# EAGLE design CubeX2000 (EAGLE 6.5.0)
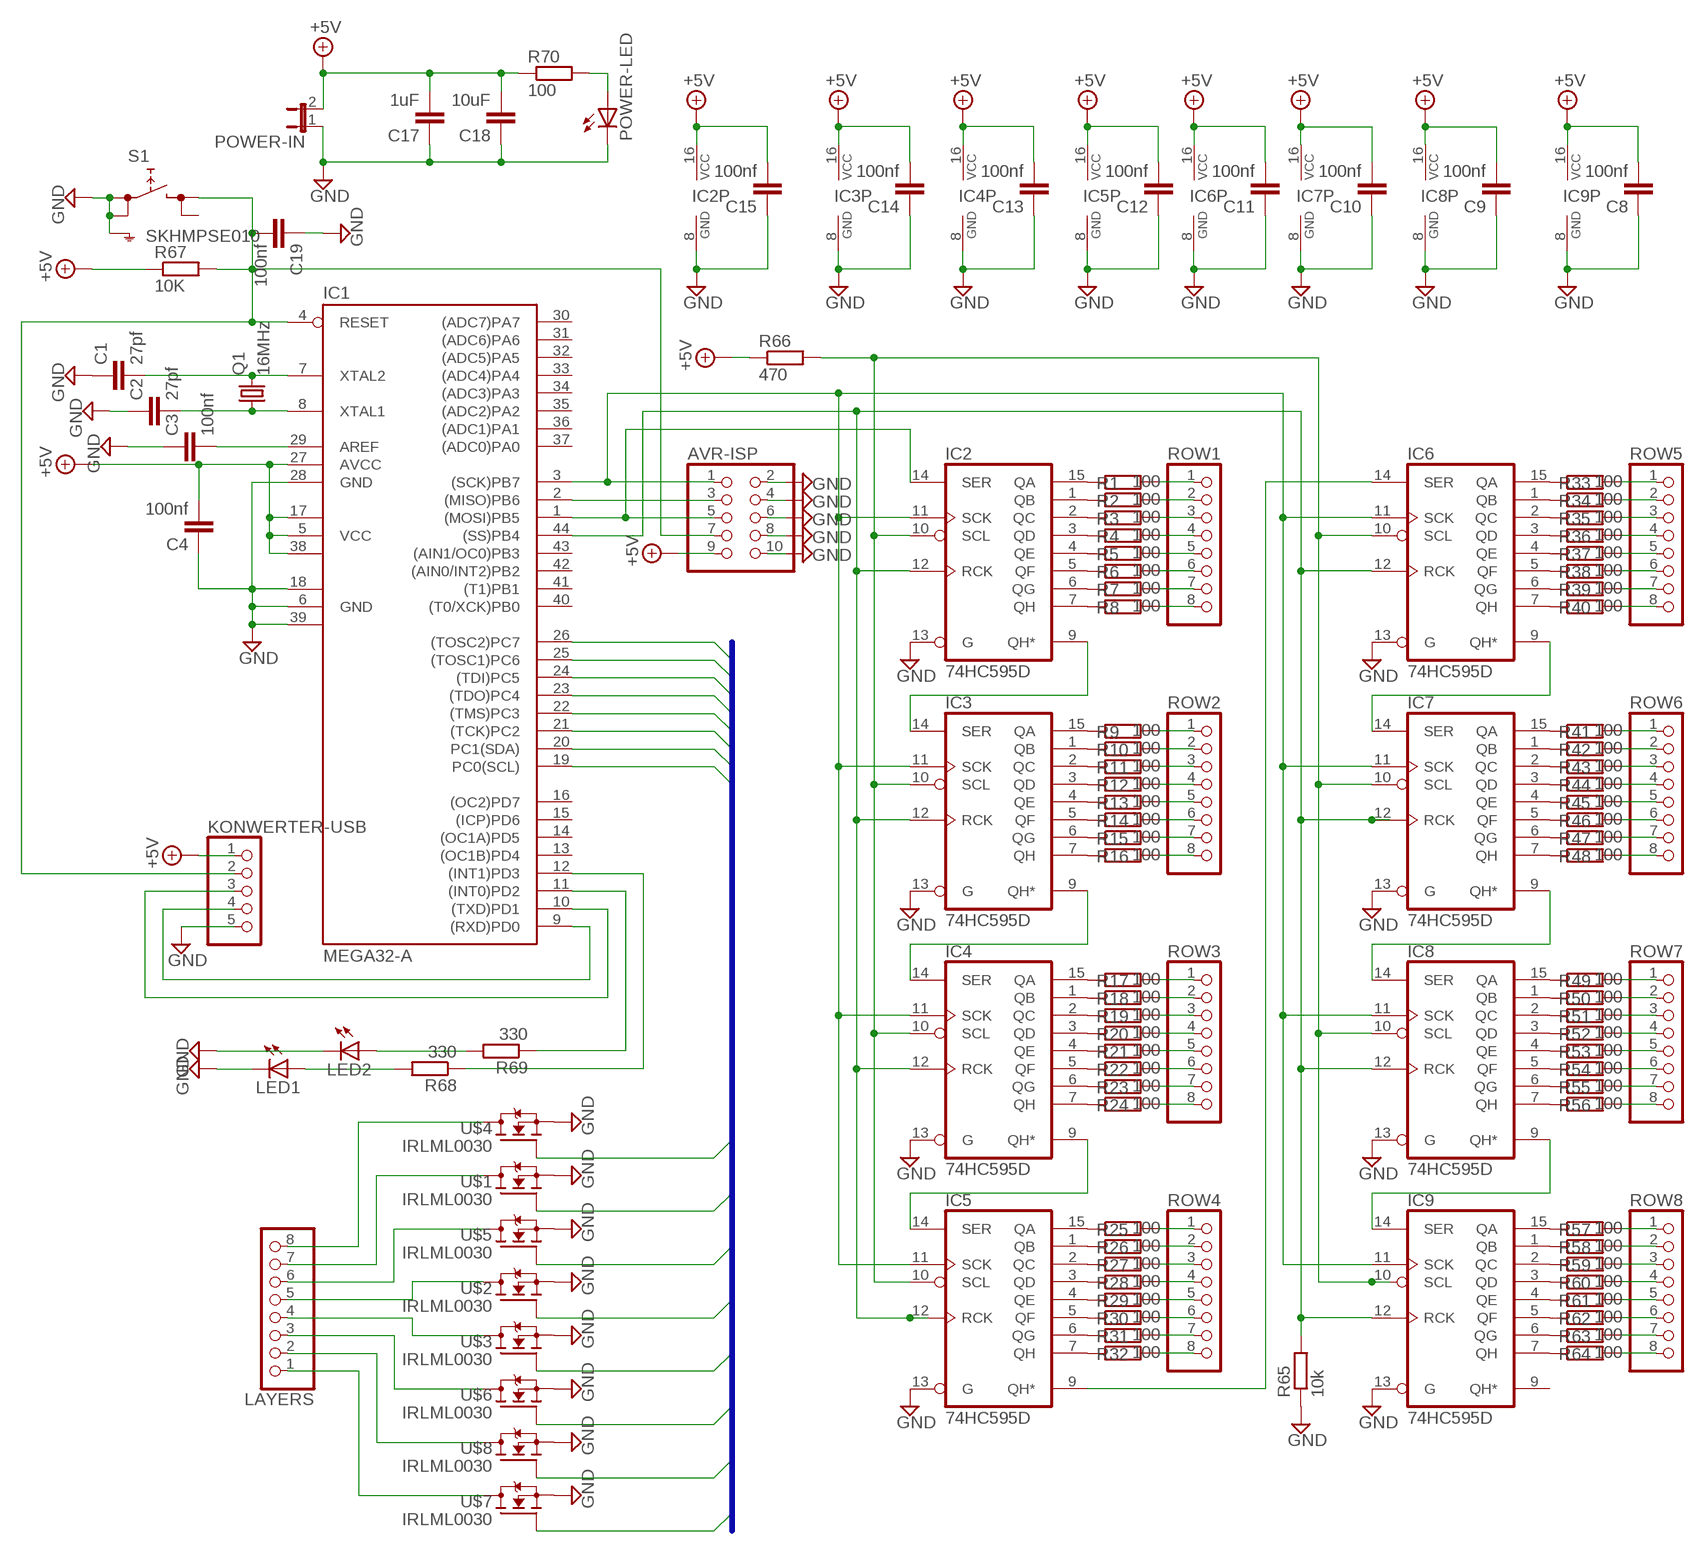
[diagram p0: schematic, sheet 1]

## Parts
AVR-ISP  PINHD-2X5  [2X05]
C1  27pf  C-EUC1206  [C1206]
C2  27pf  C-EUC1206  [C1206]
C3  100nf  C-EUC1206  [C1206]
C4  100nf  C-EUC1206  [C1206]
C8  100nf  C-EUC1206  [C1206]
C9  100nf  C-EUC1206  [C1206]
C10  100nf  C-EUC1206  [C1206]
C11  100nf  C-EUC1206  [C1206]
C12  100nf  C-EUC1206  [C1206]
C13  100nf  C-EUC1206  [C1206]
C14  100nf  C-EUC1206  [C1206]
C15  100nf  C-EUC1206  [C1206]
C17  1uF  C-EUC1206  [C1206]
C18  10uF  C-EUC1206  [C1206]
C19  100nf  C-EUC1206  [C1206]
IC1  MEGA32-A  [TQFP44]
IC2  74HC595D  [SO16]
IC3  74HC595D  [SO16]
IC4  74HC595D  [SO16]
IC5  74HC595D  [SO16]
IC6  74HC595D  [SO16]
IC7  74HC595D  [SO16]
IC8  74HC595D  [SO16]
IC9  74HC595D  [SO16]
KONWERTER-USB  PINHD-1X5  [1X05]
LAYERS  PINHD-1X8  [1X08]
LED1  LEDSMT1206  [1206]
LED2  LEDSMT1206  [1206]
POWER-IN  JP1E  [JP1]
POWER-LED  LEDSMT1206  [1206]
Q1  16MHz  CRYSTALHC49S  [HC49/S]
R1  100  R-EU_R1206  [R1206]
R2  100  R-EU_R1206  [R1206]
R3  100  R-EU_R1206  [R1206]
R4  100  R-EU_R1206  [R1206]
R5  100  R-EU_R1206  [R1206]
R6  100  R-EU_R1206  [R1206]
R7  100  R-EU_R1206  [R1206]
R8  100  R-EU_R1206  [R1206]
R9  100  R-EU_R1206  [R1206]
R10  100  R-EU_R1206  [R1206]
R11  100  R-EU_R1206  [R1206]
R12  100  R-EU_R1206  [R1206]
R13  100  R-EU_R1206  [R1206]
R14  100  R-EU_R1206  [R1206]
R15  100  R-EU_R1206  [R1206]
R16  100  R-EU_R1206  [R1206]
R17  100  R-EU_R1206  [R1206]
R18  100  R-EU_R1206  [R1206]
R19  100  R-EU_R1206  [R1206]
R20  100  R-EU_R1206  [R1206]
R21  100  R-EU_R1206  [R1206]
R22  100  R-EU_R1206  [R1206]
R23  100  R-EU_R1206  [R1206]
R24  100  R-EU_R1206  [R1206]
R25  100  R-EU_R1206  [R1206]
R26  100  R-EU_R1206  [R1206]
R27  100  R-EU_R1206  [R1206]
R28  100  R-EU_R1206  [R1206]
R29  100  R-EU_R1206  [R1206]
R30  100  R-EU_R1206  [R1206]
R31  100  R-EU_R1206  [R1206]
R32  100  R-EU_R1206  [R1206]
R33  100  R-EU_R1206  [R1206]
R34  100  R-EU_R1206  [R1206]
R35  100  R-EU_R1206  [R1206]
R36  100  R-EU_R1206  [R1206]
R37  100  R-EU_R1206  [R1206]
R38  100  R-EU_R1206  [R1206]
R39  100  R-EU_R1206  [R1206]
R40  100  R-EU_R1206  [R1206]
R41  100  R-EU_R1206  [R1206]
R42  100  R-EU_R1206  [R1206]
R43  100  R-EU_R1206  [R1206]
R44  100  R-EU_R1206  [R1206]
R45  100  R-EU_R1206  [R1206]
R46  100  R-EU_R1206  [R1206]
R47  100  R-EU_R1206  [R1206]
R48  100  R-EU_R1206  [R1206]
R49  100  R-EU_R1206  [R1206]
R50  100  R-EU_R1206  [R1206]
R51  100  R-EU_R1206  [R1206]
R52  100  R-EU_R1206  [R1206]
R53  100  R-EU_R1206  [R1206]
R54  100  R-EU_R1206  [R1206]
R55  100  R-EU_R1206  [R1206]
R56  100  R-EU_R1206  [R1206]
R57  100  R-EU_R1206  [R1206]
R58  100  R-EU_R1206  [R1206]
R59  100  R-EU_R1206  [R1206]
R60  100  R-EU_R1206  [R1206]
R61  100  R-EU_R1206  [R1206]
R62  100  R-EU_R1206  [R1206]
R63  100  R-EU_R1206  [R1206]
R64  100  R-EU_R1206  [R1206]
R65  10k  R-EU_R1206  [R1206]
R66  470  R-EU_R1206  [R1206]
R67  10K  R-EU_R1206  [R1206]
R68  330  R-EU_R1206  [R1206]
R69  330  R-EU_R1206  [R1206]
R70  100  R-EU_R1206  [R1206]
ROW1  PINHD-1X8  [1X08]
ROW2  PINHD-1X8  [1X08]
ROW3  PINHD-1X8  [1X08]
ROW4  PINHD-1X8  [1X08]
ROW5  PINHD-1X8  [1X08]
ROW6  PINHD-1X8  [1X08]
ROW7  PINHD-1X8  [1X08]
ROW8  PINHD-1X8  [1X08]
S1  SKHMPSE010  [SKHMPXE010]
U$1  IRLML0030  [SOT23]
U$2  IRLML0030  [SOT23]
U$3  IRLML0030  [SOT23]
U$4  IRLML0030  [SOT23]
U$5  IRLML0030  [SOT23]
U$6  IRLML0030  [SOT23]
U$7  IRLML0030  [SOT23]
U$8  IRLML0030  [SOT23]

## Nets
+5V: AVR-ISP.9 C4.2 C8.2 C9.2 C10.2 C11.2 C12.2 C13.2 C14.2 C15.2 C17.2 C18.2 IC1.5(VCC) IC1.17(VCC1) IC1.27(AVCC) IC1.38(VCC2) IC2.16(VCC) IC3.16(VCC) IC4.16(VCC) IC5.16(VCC) IC6.16(VCC) IC7.16(VCC) IC8.16(VCC) IC9.16(VCC) KONWERTER-USB.1 POWER-IN.2 R66.1 R67.1 R70.1
GND: AVR-ISP.2 AVR-ISP.4 AVR-ISP.6 AVR-ISP.8 AVR-ISP.10 C1.1 C2.1 C3.1 C4.1 C8.1 C9.1 C10.1 C11.1 C12.1 C13.1 C14.1 C15.1 C17.1 C18.1 C19.1 IC1.6(GND) IC1.18(GND1) IC1.28(GND) IC1.39(GND2) IC2.8(GND) IC2.13(G) IC3.8(GND) IC3.13(G) IC4.8(GND) IC4.13(G) IC5.8(GND) IC5.13(G) IC6.8(GND) IC6.13(G) IC7.8(GND) IC7.13(G) IC8.8(GND) IC8.13(G) IC9.8(GND) IC9.13(G) KONWERTER-USB.5 LED1.C LED2.C POWER-IN.1 POWER-LED.C R65.1 S1.1(1.1) S1.2(1.2) S1.5(SH) U$1.2(S) U$2.2(S) U$3.2(S) U$4.2(S) U$5.2(S) U$6.2(S) U$7.2(S) U$8.2(S)
LAYERS1: IC1.19(PC0(SCL)) U$7.1(G)
LAYERS2: IC1.20(PC1(SDA)) U$8.1(G)
LAYERS3: IC1.21((TCK)PC2) U$6.1(G)
LAYERS4: IC1.22((TMS)PC3) U$3.1(G)
LAYERS5: IC1.23((TDO)PC4) U$2.1(G)
LAYERS6: IC1.24((TDI)PC5) U$5.1(G)
LAYERS7: IC1.25((TOSC1)PC6) U$1.1(G)
LAYERS8: IC1.26((TOSC2)PC7) U$4.1(G)
N$1: IC2.15(QA) R1.1
N$2: IC2.1(QB) R2.1
N$3: IC2.2(QC) R3.1
N$4: IC2.3(QD) R4.1
N$5: IC2.4(QE) R5.1
N$6: IC2.5(QF) R6.1
N$7: IC2.6(QG) R7.1
N$8: IC2.7(QH) R8.1
N$9: IC3.15(QA) R9.1
N$10: IC3.1(QB) R10.1
N$11: IC3.2(QC) R11.1
N$12: IC3.3(QD) R12.1
N$13: IC3.4(QE) R13.1
N$14: IC3.5(QF) R14.1
N$15: IC3.6(QG) R15.1
N$16: IC3.7(QH) R16.1
N$17: IC4.15(QA) R17.1
N$18: IC4.1(QB) R18.1
N$19: IC4.2(QC) R19.1
N$20: IC4.3(QD) R20.1
N$21: IC4.4(QE) R21.1
N$22: IC4.5(QF) R22.1
N$23: IC4.6(QG) R23.1
N$24: IC4.7(QH) R24.1
N$25: IC5.15(QA) R25.1
N$26: IC5.1(QB) R26.1
N$27: IC5.2(QC) R27.1
N$28: IC5.3(QD) R28.1
N$29: IC5.4(QE) R29.1
N$30: IC5.5(QF) R30.1
N$31: IC5.6(QG) R31.1
N$32: IC5.7(QH) R32.1
N$33: IC6.15(QA) R33.1
N$34: IC6.1(QB) R34.1
N$35: IC6.2(QC) R35.1
N$36: IC6.3(QD) R36.1
N$37: IC6.4(QE) R37.1
N$38: IC6.5(QF) R38.1
N$39: IC6.6(QG) R39.1
N$40: IC6.7(QH) R40.1
N$41: IC7.15(QA) R41.1
N$42: IC7.1(QB) R42.1
N$43: IC7.2(QC) R43.1
N$44: IC7.3(QD) R44.1
N$45: IC7.4(QE) R45.1
N$46: IC7.5(QF) R46.1
N$47: IC7.6(QG) R47.1
N$48: IC7.7(QH) R48.1
N$49: IC8.15(QA) R49.1
N$50: IC8.1(QB) R50.1
N$51: IC8.2(QC) R51.1
N$52: IC8.3(QD) R52.1
N$53: IC8.4(QE) R53.1
N$54: IC8.5(QF) R54.1
N$55: IC8.6(QG) R55.1
N$56: IC8.7(QH) R56.1
N$57: IC9.15(QA) R57.1
N$58: IC9.1(QB) R58.1
N$59: IC9.2(QC) R59.1
N$60: IC9.3(QD) R60.1
N$61: IC9.4(QE) R61.1
N$62: IC9.5(QF) R62.1
N$63: IC9.6(QG) R63.1
N$64: IC9.7(QH) R64.1
N$65: R1.2 ROW1.1
N$66: R2.2 ROW1.2
N$67: R3.2 ROW1.3
N$68: R4.2 ROW1.4
N$69: R5.2 ROW1.5
N$70: R6.2 ROW1.6
N$71: R7.2 ROW1.7
N$72: R8.2 ROW1.8
N$73: R9.2 ROW2.1
N$74: R10.2 ROW2.2
N$75: R11.2 ROW2.3
N$76: R12.2 ROW2.4
N$77: R13.2 ROW2.5
N$78: R14.2 ROW2.6
N$79: R15.2 ROW2.7
N$80: R16.2 ROW2.8
N$81: R17.2 ROW3.1
N$82: R18.2 ROW3.2
N$83: R19.2 ROW3.3
N$84: R20.2 ROW3.4
N$85: R21.2 ROW3.5
N$86: R22.2 ROW3.6
N$87: R23.2 ROW3.7
N$88: R24.2 ROW3.8
N$89: R25.2 ROW4.1
N$90: R26.2 ROW4.2
N$91: R27.2 ROW4.3
N$92: R28.2 ROW4.4
N$93: R29.2 ROW4.5
N$94: R30.2 ROW4.6
N$95: R31.2 ROW4.7
N$96: R32.2 ROW4.8
N$97: R33.2 ROW5.1
N$98: R34.2 ROW5.2
N$99: R35.2 ROW5.3
N$100: R36.2 ROW5.4
N$101: R37.2 ROW5.5
N$102: R38.2 ROW5.6
N$103: R39.2 ROW5.7
N$104: R40.2 ROW5.8
N$105: R41.2 ROW6.1
N$106: R42.2 ROW6.2
N$107: R43.2 ROW6.3
N$108: R44.2 ROW6.4
N$109: R45.2 ROW6.5
N$110: R46.2 ROW6.6
N$111: R47.2 ROW6.7
N$112: R48.2 ROW6.8
N$113: R49.2 ROW7.1
N$114: R50.2 ROW7.2
N$115: R51.2 ROW7.3
N$116: R52.2 ROW7.4
N$117: R53.2 ROW7.5
N$118: R54.2 ROW7.6
N$119: R55.2 ROW7.7
N$120: R56.2 ROW7.8
N$121: R57.2 ROW8.1
N$122: R58.2 ROW8.2
N$123: R59.2 ROW8.3
N$124: R60.2 ROW8.4
N$125: R61.2 ROW8.5
N$126: R62.2 ROW8.6
N$127: R63.2 ROW8.7
N$128: R64.2 ROW8.8
N$129: IC8.9(QH*) IC9.14(SER)
N$130: IC7.9(QH*) IC8.14(SER)
N$131: IC6.9(QH*) IC7.14(SER)
N$132: IC4.9(QH*) IC5.14(SER)
N$133: IC3.9(QH*) IC4.14(SER)
N$134: IC2.9(QH*) IC3.14(SER)
N$135: IC5.9(QH*) IC6.14(SER)
N$136: AVR-ISP.1 IC1.3((SCK)PB7) IC2.11(SCK) IC3.11(SCK) IC4.11(SCK) IC5.11(SCK) IC6.11(SCK) IC7.11(SCK) IC8.11(SCK) IC9.11(SCK)
N$137: AVR-ISP.5 IC1.1((MOSI)PB5) IC2.14(SER)
N$138: IC2.10(SCL) IC3.10(SCL) IC4.10(SCL) IC5.10(SCL) IC6.10(SCL) IC7.10(SCL) IC8.10(SCL) IC9.10(SCL) R66.2
N$139: LAYERS.5 U$2.3(D)
N$140: IC1.44((SS)PB4) IC2.12(RCK) IC3.12(RCK) IC4.12(RCK) IC5.12(RCK) IC6.12(RCK) IC7.12(RCK) IC8.12(RCK) IC9.12(RCK) R65.2
N$141: AVR-ISP.3 IC1.2((MISO)PB6)
N$142: IC1.9((RXD)PD0) KONWERTER-USB.4
N$143: IC1.10((TXD)PD1) KONWERTER-USB.3
N$150: C1.2 IC1.7(XTAL2) Q1.2
N$151: C2.2 IC1.8(XTAL1) Q1.1
N$152: C3.2 IC1.29(AREF)
N$156: LED1.A R68.2
N$157: LED2.A R69.2
N$166: IC1.11((INT0)PD2) R69.1
N$167: IC1.12((INT1)PD3) R68.1
N$168: LAYERS.6 U$5.3(D)
N$169: AVR-ISP.7 C19.2 IC1.4(RESET) KONWERTER-USB.2 R67.2 S1.3(2.1)
N$170: LAYERS.7 U$1.3(D)
N$171: LAYERS.8 U$4.3(D)
N$172: LAYERS.4 U$3.3(D)
N$173: LAYERS.3 U$6.3(D)
N$174: LAYERS.2 U$8.3(D)
N$175: LAYERS.1 U$7.3(D)
N$178: POWER-LED.A R70.2
Unconnected: IC1.13((OC1B)PD4) IC1.14((OC1A)PD5) IC1.15((ICP)PD6) IC1.16((OC2)PD7) IC1.30((ADC7)PA7) IC1.31((ADC6)PA6) IC1.32((ADC5)PA5) IC1.33((ADC4)PA4) IC1.34((ADC3)PA3) IC1.35((ADC2)PA2) IC1.36((ADC1)PA1) IC1.37((ADC0)PA0) IC1.40((T0/XCK)PB0) IC1.41((T1)PB1) IC1.42((AIN0/INT2)PB2) IC1.43((AIN1/OC0)PB3) IC9.9(QH*) S1.4(2.2)

## Buses
LAYERS[1..8]

## Library data of the parts
AVR-ISP = pinhead:PINHD-2X5: PIN HEADER
C1-C4 C8-C15 C17-C19 = resistor:C-EU: CAPACITOR, European symbol
IC1 = atmel:MEGA32: MICROCONTROLLER 32 Kbytes FLASH 2 Kbytes SRAM 1 Kbytes EEPROM USART 8-channel 10 bit ADC Source: www.atmel.com .. doc2503.pdf; MPN: ATMEGA32-16AU; OC_FARNELL: 9171274; OC_NEWARK: 69K6677
IC2-IC9 = 74xx-eu:74*595: 8-bit SHIFT REGISTER, output latch
KONWERTER-USB = pinhead:PINHD-1X5: PIN HEADER
LAYERS ROW1-ROW8 = pinhead:PINHD-1X8: PIN HEADER
LED1 LED2 POWER-LED = led:LED: LED OSRAM: - CHIPLED LG R971, LG N971, LY N971, LG Q971, LY Q971, LO R971, LY R971 LH N974, LH R974 LS Q976, LO Q976, LY Q976 LO Q996 - Hyper CHIPLED LW Q18S LB Q993, LB Q99A, LB R99A - SideLED LS A670, LO A670, LY A670, LG A670, LP A670 LB A673, LV A673, LT A673, LW A673 LH A674 LY A675 LS A676, LA A676, LO A676, LY A676, LW A676 LS A679, LY A679, LG A679 - Hyper Micro SIDELED® LS Y876, LA Y876, LO Y876, LY Y876 LT Y87S - SmartLED LW L88C, LW L88S LB L89C, LB L89S, LG L890 LS L89K, LO L89K, LY L89K LS L896, LA L896, LO L896, LY L896 - TOPLED LS T670, LO T670, LY T670, LG T670, LP T670 LSG T670, LSP T670, LSY T670, LOP T670, LYG T670 LG T671, LOG T671, LSG T671 LB T673, LV T673, LT T673, LW T673 LH T674 LS T676, LA T676, LO T676, LY T676, LB T676, LH T676, LSB T676, LW T676 LB T67C, LV T67C, LT T67C, LS T67K, LO T67K, LY T67K, LW E67C LS E67B, LA E67B, LO E67B, LY E67B, LB E67C, LV E67C, LT E67C LW T67C LS T679, LY T679, LG T679 LS T770, LO T770, LY T770, LG T770, LP T770 LB T773, LV T773, LT T773, LW T773 LH T774 LS E675, LA E675, LY E675, LS T675 LS T776, LA T776, LO T776, LY T776, LB T776 LHGB T686 LT T68C, LB T68C - Hyper Mini TOPLED® LB M676 - Mini TOPLED Santana® LG M470 LS M47K, LO M47K, LY M47K Source: http://www.osram.convergy.de LUXEON: - LUMILED® LXK2-PW12-R00, LXK2-PW12-S00, LXK2-PW14-U00, LXK2-PW14-V00 LXK2-PM12-R00, LXK2-PM12-S00, LXK2-PM14-U00 LXK2-PE12-Q00, LXK2-PE12-R00, LXK2-PE12-S00, LXK2-PE14-T00, LXK2-PE14-U00 LXK2-PB12-K00, LXK2-PB12-L00, LXK2-PB12-M00, LXK2-PB14-N00, LXK2-PB14-P00, LXK2-PB14-Q00 LXK2-PR12-L00, LXK2-PR12-M00, LXK2-PR14-Q00, LXK2-PR14-R00 LXK2-PD12-Q00, LXK2-PD12-R00, LXK2-PD12-S00 LXK2-PH12-R00, LXK2-PH12-S00 LXK2-PL12-P00, LXK2-PL12-Q00, LXK2-PL12-R00 Source: www.luxeon.com KINGBRIGHT: KA-3528ASYC Source: www.kingbright.com
POWER-IN = jumper:JP1E: JUMPER
Q1 = crystal:CRYSTAL: CRYSTAL; OC_FARNELL: 1667008; OC_NEWARK: unknown
R1-R70 = resistor:R-EU_: RESISTOR, European symbol
S1 = switch:SKHMP*E010: 6.2 X 6.5mm TACT Switch (SMD) Source: http://www3.alps.co.jp/WebObjects/catalog.woa/PDF/E/Switch/Tact/SKHM/SKHM.PDF
U$1-U$8 = transistor-fet:IRLML0030

## Board
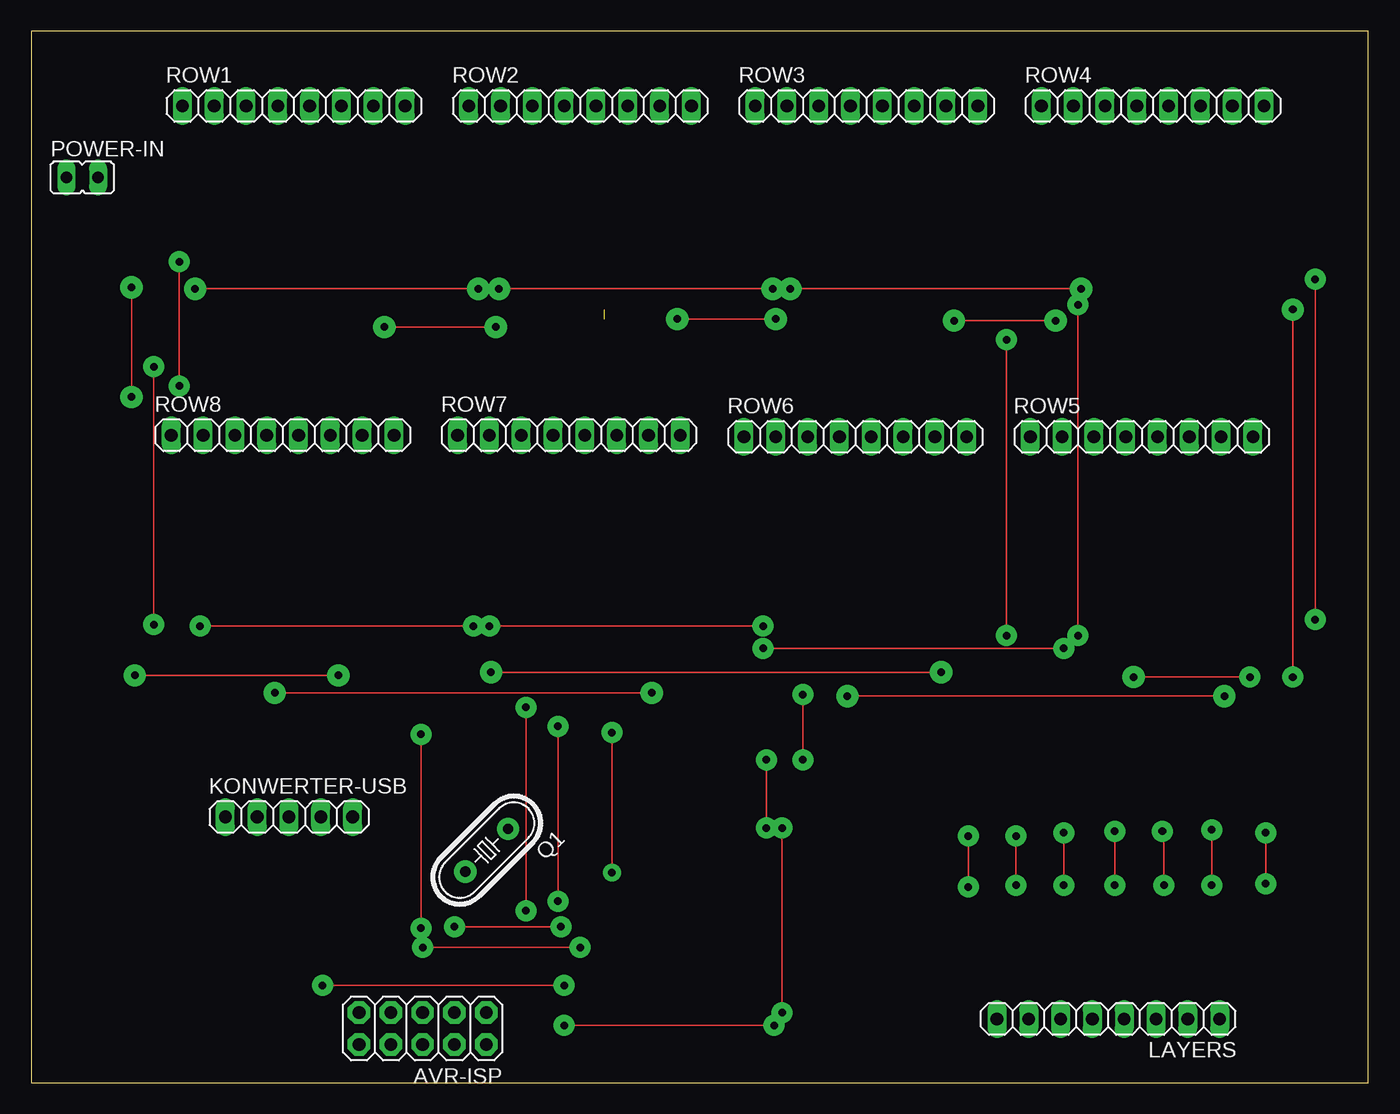
[diagram p1: board, top side]
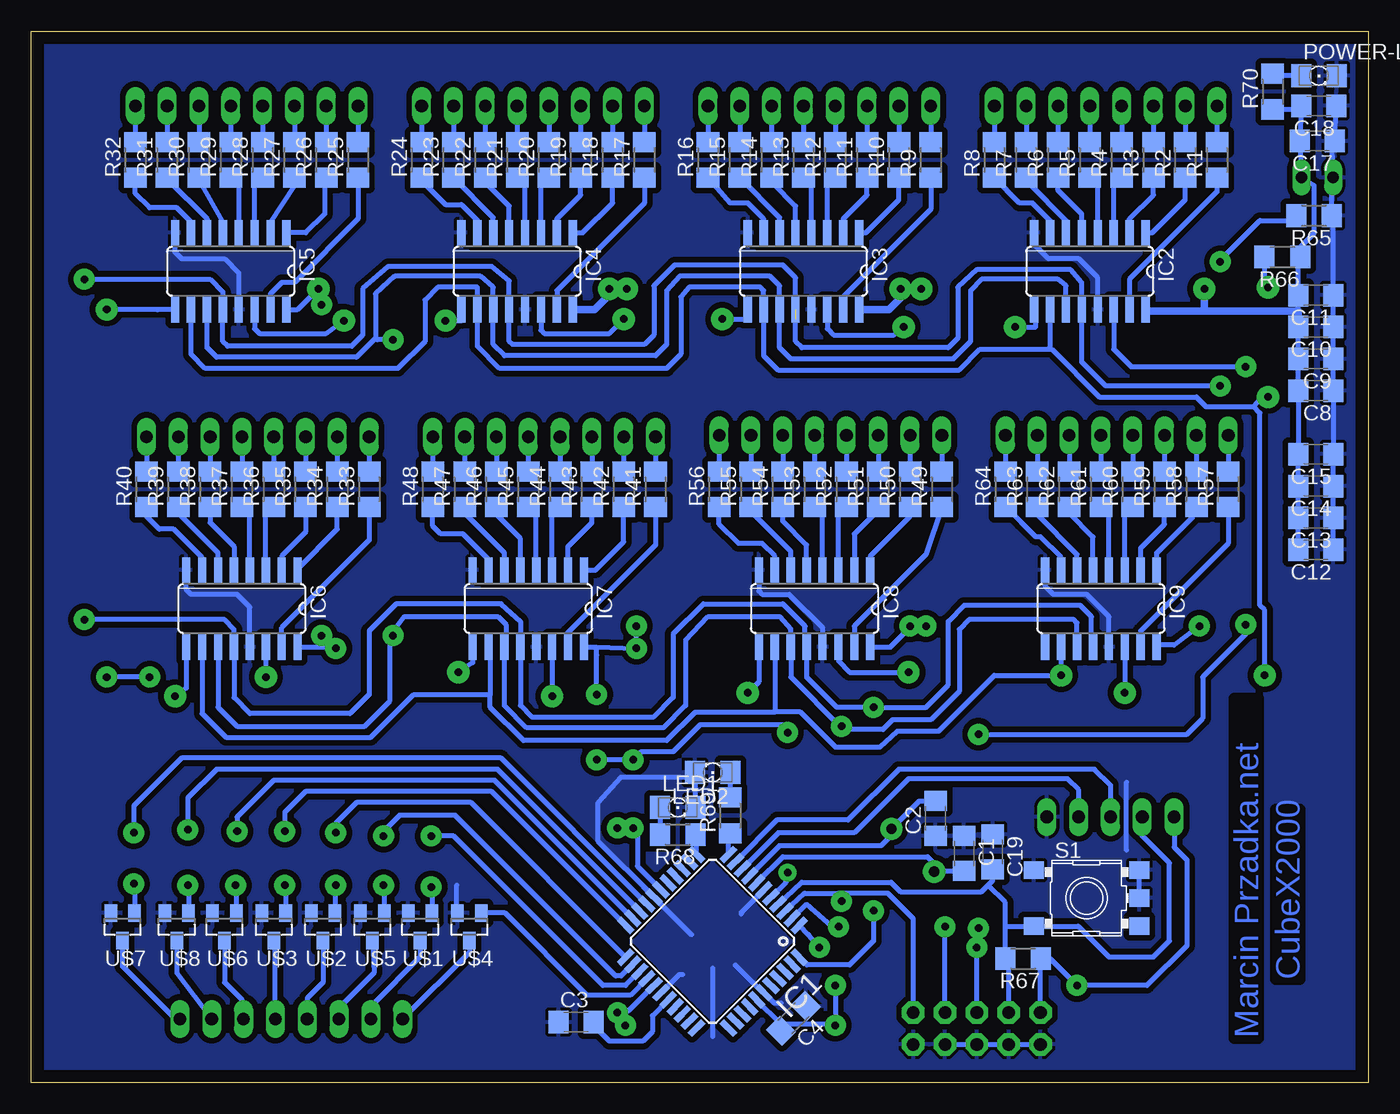
[diagram p2: board, bottom side, seen from below]

Size 106.73 x 83.94 mm. Coordinates in mm from the lower left corner, seen from the top.
Outline: 0,0 106.73,0 106.73,83.94 0,83.94 0,0
Copper layers (1*16): Top 0.035mm / dielectric 1.5mm / Bottom 0.035mm
Design rules "default": minimum track width 10mil, minimum drill 24mil, track to track 8mil, track to pad 8mil, pad to pad 8mil, via to via 8mil, smd to smd 8mil, copper to edge 40mil, drill to drill 8mil, minimum pad ring 10mil, minimum via ring 8mil, stop-mask expansion 4mil, vias tented up to drill 0mil, thermal gap 10mil

### Footprints (pad centres in the part's own frame; a part is rotated, then mirrored left to right if it is on the bottom)
2X05 = drill 1.016 pad 1.778 octagon: 1 -5.08,-1.27; 2 -5.08,1.27; 3 -2.54,-1.27; 4 -2.54,1.27; 5 0,-1.27; 6 0,1.27; 7 2.54,-1.27; 8 2.54,1.27; 9 5.08,-1.27; 10 5.08,1.27
C1206 = smd 1.6 x 1.8: 1 -1.4,0; 2 1.4,0
TQFP44 = smd 1.5 x 0.5: 1 -5.8,4; 2 -5.8,3.2; 3 -5.8,2.4; 4 -5.8,1.6; 5 -5.8,0.8; 6 -5.8,0; 7 -5.8,-0.8; 8 -5.8,-1.6; 9 -5.8,-2.4; 10 -5.8,-3.2; 11 -5.8,-4; 23 5.8,-4; 24 5.8,-3.2; 25 5.8,-2.4; 26 5.8,-1.6; 27 5.8,-0.8; 28 5.8,0; 29 5.8,0.8; 30 5.8,1.6; 31 5.8,2.4; 32 5.8,3.2; 33 5.8,4 | smd 0.5 x 1.5: 12 -4,-5.8; 13 -3.2,-5.8; 14 -2.4,-5.8; 15 -1.6,-5.8; 16 -0.8,-5.8; 17 0,-5.8; 18 0.8,-5.8; 19 1.6,-5.8; 20 2.4,-5.8; 21 3.2,-5.8; 22 4,-5.8; 34 4,5.8; 35 3.2,5.8; 36 2.4,5.8; 37 1.6,5.8; 38 0.8,5.8; 39 0,5.8; 40 -0.8,5.8; 41 -1.6,5.8; 42 -2.4,5.8; 43 -3.2,5.8; 44 -4,5.8
SO16 = smd 0.66 x 2.032: 1 -4.445,-3.073; 2 -3.175,-3.073; 3 -1.905,-3.073; 4 -0.635,-3.073; 5 0.635,-3.073; 6 1.905,-3.073; 7 3.175,-3.073; 8 4.445,-3.073; 9 4.445,3.073; 10 3.175,3.073; 11 1.905,3.073; 12 0.635,3.073; 13 -0.635,3.073; 14 -1.905,3.073; 15 -3.175,3.073; 16 -4.445,3.073
1X05 = drill 1.016 long: 1 -5.08,0; 2 -2.54,0; 3 0,0; 4 2.54,0; 5 5.08,0
1X08 = drill 1.016 long: 1 -8.89,0; 2 -6.35,0; 3 -3.81,0; 4 -1.27,0; 5 1.27,0; 6 3.81,0; 7 6.35,0; 8 8.89,0
1206 = smd 1.6 x 1.803: A -1.422,0; C 1.422,0
JP1 = drill 0.914 long: 1 0,-1.27; 2 0,1.27
HC49/S = drill 0.813 pad 1.778: 1 -2.413,0; 2 2.413,0
R1206 = smd 1.6 x 1.803: 1 -1.422,0; 2 1.422,0
SKHMPXE010 = smd 1.6 x 1.4: 1 -4.2,2.25; 2 4.2,2.25; 3 -4.2,-2.25; 4 4.2,-2.25; 5 4.2,0
SOT23 = smd 1 x 1.4: 1 -0.95,-1.1; 2 0.95,-1.1; 3 0,1.1

### Placement (x,y rotation side)
AVR-ISP  31.24,4.32 180 top
C1  32.26,18.29 270 bottom
C2  34.54,21.08 90 bottom
C3  63.25,4.83 0 bottom
C4  45.89,5.12 225 bottom
C8  4.19,55.24 180 bottom
C9  4.19,57.78 180 bottom
C10  4.19,60.33 180 bottom
C11  4.19,62.87 180 bottom
C12  4.19,42.55 180 bottom
C13  4.19,45.09 180 bottom
C14  4.19,47.62 180 bottom
C15  4.19,50.16 180 bottom
C17  4.06,75.18 180 bottom
C18  3.94,77.98 180 bottom
C19  29.97,18.41 270 bottom
IC1  52.35,11.28 225 bottom
IC2  22.23,64.77 180 bottom
IC3  45.09,64.77 180 bottom
IC4  67.94,64.77 180 bottom
IC5  90.8,64.77 180 bottom
IC6  89.92,37.85 180 bottom
IC7  67.06,37.85 180 bottom
IC8  44.2,37.85 180 bottom
IC9  21.34,37.85 180 bottom
KONWERTER-USB  20.57,21.21 0 top
LAYERS  85.98,5.08 180 top
LED1  55.12,21.97 0 bottom
LED2  52.32,24.77 180 bottom
POWER-IN  4.06,72.26 270 top
POWER-LED  3.94,80.39 0 bottom
Q1  36.36,18.56 225 top
R1  12.06,73.66 90 bottom
R2  14.61,73.66 90 bottom
R3  17.14,73.66 90 bottom
R4  19.68,73.66 90 bottom
R5  22.23,73.66 90 bottom
R6  24.77,73.66 90 bottom
R7  27.3,73.66 90 bottom
R8  29.84,73.66 90 bottom
R9  34.93,73.66 90 bottom
R10  37.47,73.66 90 bottom
R11  40.01,73.66 90 bottom
R12  42.55,73.66 90 bottom
R13  45.09,73.66 90 bottom
R14  47.62,73.66 90 bottom
R15  50.17,73.66 90 bottom
R16  52.71,73.66 90 bottom
R17  57.79,73.66 90 bottom
R18  60.33,73.66 90 bottom
R19  62.87,73.66 90 bottom
R20  65.41,73.66 90 bottom
R21  67.94,73.66 90 bottom
R22  70.48,73.66 90 bottom
R23  73.02,73.66 90 bottom
R24  75.56,73.66 90 bottom
R25  80.64,73.66 90 bottom
R26  83.19,73.66 90 bottom
R27  85.72,73.66 90 bottom
R28  88.27,73.66 90 bottom
R29  90.8,73.66 90 bottom
R30  93.34,73.66 90 bottom
R31  95.88,73.66 90 bottom
R32  98.42,73.66 90 bottom
R33  79.76,47.37 90 bottom
R34  82.3,47.37 90 bottom
R35  84.84,47.37 90 bottom
R36  87.38,47.37 90 bottom
R37  89.92,47.37 90 bottom
R38  92.46,47.37 90 bottom
R39  95,47.37 90 bottom
R40  97.54,47.37 90 bottom
R41  56.9,47.37 90 bottom
R42  59.44,47.37 90 bottom
R43  61.98,47.37 90 bottom
R44  64.52,47.37 90 bottom
R45  67.06,47.37 90 bottom
R46  69.6,47.37 90 bottom
R47  72.14,47.37 90 bottom
R48  74.68,47.37 90 bottom
R49  34.04,47.37 90 bottom
R50  36.58,47.37 90 bottom
R51  39.12,47.37 90 bottom
R52  41.66,47.37 90 bottom
R53  44.2,47.37 90 bottom
R54  46.74,47.37 90 bottom
R55  49.28,47.37 90 bottom
R56  51.82,47.37 90 bottom
R57  11.18,47.37 90 bottom
R58  13.72,47.37 90 bottom
R59  16.26,47.37 90 bottom
R60  18.8,47.37 90 bottom
R61  21.34,47.37 90 bottom
R62  23.88,47.37 90 bottom
R63  26.42,47.37 90 bottom
R64  28.96,47.37 90 bottom
R65  4.32,69.22 180 bottom
R66  6.86,65.91 180 bottom
R67  27.56,9.91 180 bottom
R68  55.12,19.81 180 bottom
R69  50.93,21.34 90 bottom
R70  7.62,79.12 90 bottom
ROW1  20.95,77.98 0 top
ROW2  43.82,77.98 0 top
ROW3  66.67,77.98 0 top
ROW4  89.53,77.98 0 top
ROW5  88.65,51.56 0 top
ROW6  65.79,51.56 0 top
ROW7  42.93,51.69 0 top
ROW8  20.07,51.69 0 top
S1  22.48,14.73 0 bottom
U$1  75.69,12.45 180 bottom
U$2  83.44,12.45 180 bottom
U$3  87.38,12.45 180 bottom
U$4  71.75,12.45 180 bottom
U$5  79.5,12.45 180 bottom
U$6  91.31,12.45 180 bottom
U$7  99.44,12.45 180 bottom
U$8  95.12,12.45 180 bottom

### Tracks (layer width: path | path; a pad name or v marks a point on that pad's centre or on a via)
+5V  (via drill 0.6 pad 1.42, 0.6 pad 1.68, 0.6 pad 1.78)
  Top 0.1: v83.82,63.37 v60.58,63.37 | v59.18,63.37 v37.34,63.37 | v35.69,63.37 v13.08,63.37 | v82.42,34.67 v58.42,34.67 | v58.42,36.45 v36.58,36.45 | v35.31,36.45 v13.46,36.45 | v83.57,62.1 v83.57,35.69 | v59.94,5.59 v59.94,20.32 | v59.31,4.57 v42.55,4.57 | v46.36,16.76 v46.36,27.94 | v58.67,20.32 v58.67,25.78 | v61.6,25.78 v61.6,30.99 | v23.24,7.75 v42.55,7.75
  Bottom 0.406: C12.2 C13.2 C14.2 C15.2 C8.2 C9.2 C10.2 C11.2 5.59,65.76 R66.1 5.44,66.7 4.32,67.82 4.32,71.63 POWER-IN.2 5.34,72.9 C17.2 C18.2 5.24,77.7 R70.1 | C4.2 46.88,4.68 | 46.88,4.68 43.58,4.68 42.55,4.7 | AVR-ISP.9 26.16,9.88 R67.1 25.4,9.91 v23.24,7.75 17.65,7.75 14.48,10.92 14.48,17.78 15.49,18.8 KONWERTER-USB.1 | IC6.16 84.48,34.77 82.42,34.8 | 82.42,34.8 v82.42,34.67 | v58.42,36.45 v58.42,34.67 61.62,34.77 | v13.46,36.45 15.49,34.92 16.74,34.92 IC9.16 | IC8.16 38.12,34.77 36.45,36.45 v36.58,36.45 v35.31,36.45 | IC7.16 61.62,34.77 | IC5.16 86.33,61.72 85.47,61.72 84.2,62.99 | 48.9,6.61 IC1.38 46.88,4.68 | v61.6,30.99 61.6,34.11 61.62,34.77 | 56.4,15.38 IC1.17 58.35,17.28 58.35,20.38 v58.67,20.32 v59.94,20.32 | v59.31,4.57 v59.94,5.59 59.57,5.71 59.06,5.71 57.66,7.11 IC1.27 | IC1.5 47.67,14.81 46.48,16 v46.36,16.76 | v83.57,35.69 82.42,34.8 | 84.2,62.99 v83.82,63.37 | v83.57,62.1 83.82,62.74 84.2,62.99 | v61.6,25.78 v58.67,25.78 58.04,26.42 55.5,26.42 53.34,28.57 46.61,28.57 v46.36,27.94 | v42.55,7.75 42.55,4.7 | 42.55,4.7 v42.55,4.57
  Bottom 0.61: IC2.16 17.78,61.59 13.08,61.59 | 13.08,61.59 5.59,61.59 C10.2 | v60.58,63.37 60.07,63.37 | 60.07,63.37 v59.18,63.37 | v37.34,63.37 36.58,63.37 | 36.58,63.37 v35.69,63.37 | v13.08,63.37 13.08,61.59 | IC3.16 38.25,61.7 36.58,63.37 | IC4.16 61.75,61.7 60.07,63.37
GND
  Bottom 0.406: C12.1 C13.1 C14.1 C15.1 C8.1 C9.1 C10.1 C11.1 2.79,69.11 R65.1 2.9,72.75 POWER-IN.1 2.92,75.82 C17.1 C18.1 | IC2.13 21.59,64.26 23.11,65.79 25.53,65.79 26.67,66.93 IC2.8 | IC5.13 90.17,64.64 91.31,65.79 94.74,65.79 95.25,66.29 IC5.8 | IC8.8 48.64,39.24 48.39,38.99 46.23,38.99 43.56,36.32 IC8.13 | IC6.13 89.28,37.97 90.3,38.99 93.98,38.99 94.36,39.37 IC6.8 | IC9.8 25.78,39.62 25.15,38.99 22.48,38.99 20.7,37.21 IC9.13 | 53.75,24.38 53.75,22.66 LED1.C | U$4.2 72.77,13.61 72.77,15.75 | C3.1 64.9,4.83 65.15,5.08 | AVR-ISP.4 AVR-ISP.6 AVR-ISP.8 AVR-ISP.10 | IC1.18 61.47,19.26 61.47,22.35 59.69,24.38 53.75,24.38 | LED2.C 53.75,24.38 | S1.5 S1.2 | C19.1 | 52.32,3.68 52.32,9.14 | 50.55,9.4 48.33,7.18 IC1.39 47.42,6.35 46.86,6.35 | IC1.28 55,8.64 54.74,8.64 | IC1.6 50.04,13.59 50.04,13.46 | 57.88,15.67 54.02,11.81 | 19.3,18.54 19.3,24
  pour Bottom (isolate 0.45): -1.78,-1.9 -1.78,85.6 108.46,85.6 108.46,-1.9
LAYERS1  (via drill 0.6 pad 1.68)
  Top 0.1: v98.55,19.94 v98.55,15.88
  Bottom 0.406: IC1.19 69.24,25.91 94.74,25.91 98.55,22.1 v98.55,19.94 | v98.55,15.88 98.49,15.31 U$7.1
LAYERS2  (via drill 0.6 pad 1.68)
  Top 0.1: v94.23,20.19 v94.23,15.75
  Bottom 0.406: IC1.20 69.49,25.02 91.95,25.02 94.23,22.73 v94.23,20.19 | v94.23,15.75 94.17,15.05 U$8.1
LAYERS3  (via drill 0.6 pad 1.68)
  Top 0.1: v90.3,20.07 90.42,19.94 v90.42,15.75
  Bottom 0.406: IC1.21 69.73,24.13 87.38,24.13 90.3,21.21 v90.3,20.07 | v90.42,15.75 90.36,15.18 U$6.1
LAYERS4  (via drill 0.6 pad 1.68)
  Top 0.1: v86.49,20.07 v86.49,15.75
  Bottom 0.406: IC1.22 69.97,23.24 84.84,23.24 86.49,21.59 v86.49,20.07 | v86.49,15.75 86.43,15.18 U$3.1
LAYERS5  (via drill 0.6 pad 1.68)
  Top 0.1: v82.42,19.94 v82.42,15.75
  Bottom 0.406: IC1.23 71.63,22.35 80.77,22.35 82.42,20.7 v82.42,19.94 | v82.42,15.75 82.49,15.3 U$2.1
LAYERS6  (via drill 0.6 pad 1.68)
  Top 0.1: v78.61,19.68 v78.61,15.75
  Bottom 0.406: IC1.24 59.65,8.51 60.07,8.51 72.9,21.34 77.34,21.34 78.61,20.07 v78.61,19.68 | v78.61,15.75 78.55,15.31 U$5.1
LAYERS7  (via drill 0.6 pad 1.68)
  Top 0.1: v74.8,19.68 v74.8,15.62
  Bottom 0.406: IC1.25 59.28,7.75 61.09,7.75 73.02,19.68 v74.8,19.68 | v74.8,15.62 74.74,15.31 U$1.1
LAYERS8
  Bottom 0.406: IC1.26 58.91,6.98 62.36,6.98 68.92,13.55 U$4.1
N$1
  Bottom 0.406: R1.1 12.06,71.12 19.05,64.14 IC2.15
N$2
  Bottom 0.406: IC2.1 17.25,67.84 14.61,70.48 R2.1
N$3
  Bottom 0.406: IC2.2 19.05,68.96 17.14,70.87 R3.1
N$4
  Bottom 0.406: IC2.3 20.32,71.6 R4.1
N$5
  Bottom 0.406: IC2.4 21.59,71.6 R5.1
N$6
  Bottom 0.406: IC2.5 22.86,69.34 24.77,71.25 R6.1
N$7
  Bottom 0.406: IC2.6 24.13,68.83 27.05,71.76 27.05,71.98 R7.1
N$8
  Bottom 0.406: IC2.7 25.4,68.83 26.8,70.23 27.84,70.23 R8.1
N$9
  Bottom 0.406: IC3.15 41.91,62.74 34.93,69.72 R9.1
N$10
  Bottom 0.406: IC3.1 40.11,67.84 37.47,70.48 R10.1
N$11
  Bottom 0.406: IC3.2 41.91,68.96 40.01,70.87 R11.1
N$12
  Bottom 0.406: IC3.3 43.18,71.6 R12.1
N$13
  Bottom 0.406: IC3.4 44.45,71.6 R13.1
N$14
  Bottom 0.406: IC3.5 45.72,69.98 47.5,71.76 47.5,72.11 R14.1
N$15
  Bottom 0.406: IC3.6 46.99,69.06 R15.1
N$16
  Bottom 0.406: IC3.7 48.26,68.96 49.53,70.23 50.93,70.23 52.45,72.01 R16.1
N$17
  Bottom 0.406: IC4.15 64.77,63.25 57.79,70.23 R17.1
N$18
  Bottom 0.406: IC4.1 62.71,67.84 60.33,70.23 R18.1
N$19
  Bottom 0.406: IC4.2 64.77,68.96 62.87,70.87 R19.1
N$20
  Bottom 0.406: IC4.3 66.04,71.6 R20.1
N$21
  Bottom 0.406: IC4.4 67.31,72.26 67.44,72.39 67.79,72.39 R21.1
N$22
  Bottom 0.406: IC4.5 68.58,69.98 70.23,71.63 70.23,71.98 R22.1
N$23
  Bottom 0.406: IC4.6 69.85,69.06 R23.1
N$24
  Bottom 0.406: R24.1 75.56,72.01 73.66,70.1 72.39,70.1 71.12,68.83 IC4.7
N$25
  Bottom 0.406: IC5.15 87.63,62.99 86.74,63.88 85.72,63.88 80.64,68.96 R25.1
N$26
  Bottom 0.406: R26.1 83.31,72.11 83.31,69.34 84.81,67.84 IC5.1
N$27
  Bottom 0.406: IC5.2 87.63,68.71 85.72,71.63 R27.1
N$28
  Bottom 0.406: 87.63,72.39 R28.1 88.9,71.6 IC5.3
N$29
  Bottom 0.406: R29.1 90.17,71.6 IC5.4
N$30
  Bottom 0.406: R30.1 93.34,72.01 91.44,68.71 IC5.5
N$31
  Bottom 0.406: R31.1 95.88,72.14 92.71,68.96 IC5.6
N$32
  Bottom 0.406: IC5.7 93.98,68.71 95.12,69.85 97.28,69.85 98.42,70.99 R32.1
N$33
  Bottom 0.406: IC6.15 86.74,36.32 79.76,43.31 R33.1
N$34
  Bottom 0.406: IC6.1 85.47,41.02 82.3,44.2 R34.1
N$35
  Bottom 0.406: R35.1 84.84,43.94 86.74,42.04 IC6.2
N$36
  Bottom 0.406: IC6.3 88.01,45.31 R36.1
N$37
  Bottom 0.406: IC6.4 89.28,45.31 R37.1
N$38
  Bottom 0.406: R38.1 92.46,44.7 90.55,42.8 IC6.5
N$39
  Bottom 0.406: IC6.6 91.82,42.29 95,45.47 R39.1
N$40
  Bottom 0.406: IC6.7 93.09,41.91 95.38,44.2 96.52,44.2 97.54,45.21 R40.1
N$41
  Bottom 0.406: IC7.15 63.88,35.94 56.9,42.93 R41.1
N$42
  Bottom 0.406: IC7.1 61.7,40.92 59.44,43.18 R42.1
N$43
  Bottom 0.406: IC7.2 63.88,42.8 61.98,44.7 R43.1
N$44
  Bottom 0.406: IC7.3 65.15,45.31 R44.1
N$45
  Bottom 0.406: IC7.4 66.42,45.31 R45.1
N$46
  Bottom 0.406: IC7.5 67.69,43.43 69.6,45.34 R46.1
N$47
  Bottom 0.406: IC7.6 68.96,42.29 72.14,45.47 R47.1
N$48
  Bottom 0.406: IC7.7 70.23,41.78 72.26,43.81 74.04,43.81 74.68,44.45 R48.1
N$49
  Bottom 0.406: R49.1 35.31,42.16 41.02,36.45 IC8.15
N$50
  Bottom 0.406: IC8.1 39.73,42.06 36.58,45.21 R50.1
N$51
  Bottom 0.406: R51.1 39.12,45.72 41.02,43.81 IC8.2
N$52
  Bottom 0.406: IC8.3 42.29,45.31 R52.1
N$53
  Bottom 0.406: IC8.4 43.56,45.31 R53.1
N$54
  Bottom 0.406: IC8.5 44.83,42.93 46.74,44.83 R54.1
N$55
  Bottom 0.406: IC8.6 46.1,42.42 49.02,45.34 49.02,45.7 R55.1
N$56
  Bottom 0.406: IC8.7 47.37,42.04 48.39,43.05 50.29,43.05 51.82,44.58 R56.1
N$57
  Bottom 0.406: IC9.15 18.16,36.07 11.18,43.05 R57.1
N$58
  Bottom 0.406: IC9.1 16.89,42.29 13.97,45.21 13.97,45.7 R58.1
N$59
  Bottom 0.406: IC9.2 18.16,42.67 16.26,44.58 R59.1
N$60
  Bottom 0.406: IC9.3 19.43,45.31 R60.1
N$61
  Bottom 0.406: IC9.4 20.7,45.31 R61.1
N$62
  Bottom 0.406: IC9.5 21.97,43.56 23.88,45.47 R62.1
N$63
  Bottom 0.406: IC9.6 23.24,42.16 26.42,45.34 R63.1
N$64
  Bottom 0.406: IC9.7 24.51,41.91 26.16,43.56 26.54,43.56 27.69,44.7 R64.1
N$65
  Bottom 0.406: ROW1.1 R1.2
N$66
  Bottom 0.406: ROW1.2 R2.2
N$67
  Bottom 0.406: ROW1.3 R3.2
N$68
  Bottom 0.406: ROW1.4 R4.2
N$69
  Bottom 0.406: ROW1.5 R5.2
N$70
  Bottom 0.406: ROW1.6 R6.2
N$71
  Bottom 0.406: ROW1.7 R7.2
N$72
  Bottom 0.406: ROW1.8 R8.2
N$73
  Bottom 0.406: ROW2.1 R9.2
N$74
  Bottom 0.406: ROW2.2 R10.2
N$75
  Bottom 0.406: ROW2.3 R11.2
N$76
  Bottom 0.406: ROW2.4 R12.2
N$77
  Bottom 0.406: ROW2.5 R13.2
N$78
  Bottom 0.406: ROW2.6 R14.2
N$79
  Bottom 0.406: ROW2.7 R15.2
N$80
  Bottom 0.406: ROW2.8 R16.2
N$81
  Bottom 0.406: ROW3.1 R17.2
N$82
  Bottom 0.406: ROW3.2 R18.2
N$83
  Bottom 0.406: ROW3.3 R19.2
N$84
  Bottom 0.406: ROW3.4 R20.2
N$85
  Bottom 0.406: ROW3.5 R21.2
N$86
  Bottom 0.406: ROW3.6 R22.2
N$87
  Bottom 0.406: ROW3.7 R23.2
N$88
  Bottom 0.406: ROW3.8 R24.2
N$89
  Bottom 0.406: ROW4.1 R25.2
N$90
  Bottom 0.406: ROW4.2 R26.2
N$91
  Bottom 0.406: ROW4.3 R27.2
N$92
  Bottom 0.406: ROW4.4 R28.2
N$93
  Bottom 0.406: ROW4.5 R29.2
N$94
  Bottom 0.406: ROW4.6 R30.2
N$95
  Bottom 0.406: ROW4.7 R31.2
N$96
  Bottom 0.406: ROW4.8 R32.2
N$97
  Bottom 0.406: ROW5.1 R33.2
N$98
  Bottom 0.406: ROW5.2 R34.2
N$99
  Bottom 0.406: ROW5.3 R35.2
N$100
  Bottom 0.406: ROW5.4 R36.2
N$101
  Bottom 0.406: ROW5.5 R37.2
N$102
  Bottom 0.406: ROW5.6 R38.2
N$103
  Bottom 0.406: ROW5.7 R39.2
N$104
  Bottom 0.406: ROW5.8 R40.2
N$105
  Bottom 0.406: ROW6.1 R41.2
N$106
  Bottom 0.406: ROW6.2 R42.2
N$107
  Bottom 0.406: ROW6.3 R43.2
N$108
  Bottom 0.406: ROW6.4 R44.2
N$109
  Bottom 0.406: ROW6.5 R45.2
N$110
  Bottom 0.406: ROW6.6 R46.2
N$111
  Bottom 0.406: ROW6.7 R47.2
N$112
  Bottom 0.406: ROW6.8 R48.2
N$113
  Bottom 0.406: ROW7.1 R49.2
N$114
  Bottom 0.406: ROW7.2 R50.2
N$115
  Bottom 0.406: ROW7.3 R51.2
N$116
  Bottom 0.406: ROW7.4 R52.2
N$117
  Bottom 0.406: ROW7.5 R53.2
N$118
  Bottom 0.406: ROW7.6 R54.2
N$119
  Bottom 0.406: ROW7.7 R55.2
N$120
  Bottom 0.406: ROW7.8 R56.2
N$121
  Bottom 0.406: ROW8.1 R57.2
N$122
  Bottom 0.406: ROW8.2 R58.2
N$123
  Bottom 0.406: ROW8.3 R59.2
N$124
  Bottom 0.406: ROW8.4 R60.2
N$125
  Bottom 0.406: ROW8.5 R61.2
N$126
  Bottom 0.406: ROW8.6 R62.2
N$127
  Bottom 0.406: ROW8.7 R63.2
N$128
  Bottom 0.406: ROW8.8 R64.2
N$129  (via drill 0.6 pad 1.78)
  Top 0.1: v19.43,31.11 v49.53,31.11
  Bottom 0.406: IC9.14 v19.43,31.11 | IC8.9 48.64,32 v49.53,31.11
N$130  (via drill 0.6 pad 1.78)
  Top 0.1: v72.64,32.77 v36.7,32.77
  Bottom 0.406: IC8.14 42.29,33.66 41.4,32.77 v36.7,32.77 | IC7.9 71.5,33.53 v72.64,32.77
N$131  (via drill 0.6 pad 1.78)
  Top 0.1: v65.15,30.86 v95.25,30.86
  Bottom 0.406: IC7.14 v65.15,30.86 | IC6.9 94.36,31.5 v95.25,30.86
N$132  (via drill 0.6 pad 1.78)
  Top 0.1: v81.79,60.83 v73.66,60.83
  Bottom 0.406: IC5.14 88.9,60.2 88.52,59.82 83.19,59.82 v81.79,60.83 | v73.66,60.83 72.39,60.83 IC4.9
N$133  (via drill 0.6 pad 1.78)
  Top 0.1: v59.44,60.96 v51.56,60.96
  Bottom 0.406: IC4.14 66.04,60.07 65.79,59.82 60.58,59.82 v59.44,60.96 | v51.56,60.96 49.53,60.96 IC3.9
N$134  (via drill 0.6 pad 1.78)
  Top 0.1: v37.08,60.33 v28.19,60.33
  Bottom 0.406: IC3.14 43.18,60.2 42.67,59.69 37.85,59.69 v37.08,60.33 | v28.19,60.33 26.54,60.33 26.54,61.57 IC2.9
N$135  (via drill 0.6 pad 1.68, 0.6 pad 1.78)
  Top 0.1: v100.71,61.72 v100.71,32.38 | v88.01,32.38 v97.28,32.38
  Bottom 0.406: IC6.14 v88.01,32.38 | v97.28,32.38 v100.71,32.38 | IC5.9 96.67,61.7 v100.71,61.72
N$136  (via drill 0.6 pad 1.68)
  Top 0.1: v42.04,14.48 v42.04,28.45 | v77.85,35.69 v77.85,59.31
  Bottom 0.406: 79.25,59.44 79.25,62.99 77.72,64.39 70.87,64.39 69.85,63.5 IC4.11 69.85,58.93 68.96,58.04 56.9,58.04 56.01,58.93 56.01,63.25 54.99,64.39 47.75,64.39 46.99,63.63 IC3.11 46.99,58.67 46.1,57.78 33.15,57.78 31.75,59.18 31.75,63.25 30.86,64.14 24.77,64.14 24.13,63.63 IC2.11 | IC5.11 92.71,58.67 91.95,57.91 80.77,57.91 79.25,59.44 | 45.97,34.8 45.97,34.39 IC8.11 | IC8.11 46.1,36.2 46.99,37.21 52.71,37.21 54.48,35.31 54.48,30.1 56.26,28.32 67.18,28.32 68.96,30.1 IC7.11 68.96,34.92 68.83,35.05 68.83,36.58 69.47,37.21 76.96,37.21 78.01,35.81 | AVR-ISP.1 36.32,13.08 38.35,15.11 42.29,15.11 | IC1.3 45,15.11 42.29,15.11 | 42.29,15.11 v42.04,14.48 | 78.01,35.81 78.1,35.69 78.1,30.48 80.14,28.45 90.3,28.45 91.82,29.97 IC6.11 | IC9.11 23.24,36.7 23.5,36.96 31.88,36.96 32.64,36.2 32.64,31.24 34.93,28.96 37.97,28.96 38.74,28.19 41.53,28.19 41.78,28.45 v42.04,28.45 42.04,28.32 46.1,32.38 IC8.11 | v77.85,59.31 79.12,59.31 79.25,59.44 | v77.85,35.69 77.89,35.69 78.01,35.81
N$137  (via drill 0.6 pad 1.68)
  Top 0.1: v31.24,10.79 v43.82,10.79 | v9.78,57.15 v9.78,36.58 | v31.11,27.81 v31.11,12.32
  Bottom 0.406: AVR-ISP.5 v31.24,10.79 31.11,10.92 v31.11,12.32 | v43.82,10.79 44.68,11.81 IC1.1 | IC2.14 20.32,58.55 18.92,57.15 v9.78,57.15 | v9.78,36.58 9.78,35.81 13.21,32.38 13.21,29.08 14.48,27.81 v31.11,27.81
N$138  (via drill 0.6 pad 1.78)
  Top 0.1: v8.26,32.51 v24.51,32.51 | v8,63.5 v8,54.74
  Bottom 0.406: IC5.10 93.98,58.17 92.84,57.02 77.47,57.02 75.31,59.18 75.31,62.48 74.3,63.5 71.12,63.5 IC4.10 71.12,58.8 69.34,57.02 56.01,57.02 54.86,58.17 54.86,62.74 54.23,63.5 48.51,63.5 48.26,63.25 IC3.10 48.26,58.04 47.12,56.9 32.64,56.9 30.99,58.55 25.53,58.55 | IC7.10 70.1,34.14 70.1,30.99 | IC8.10 47.37,29.59 | IC9.10 v24.51,32.51 29.84,32.51 34.29,28.07 37.59,28.07 38.99,26.8 42.55,26.8 45.34,29.59 47.37,29.59 | R66.2 8.28,63.78 v8,63.5 | 9.14,53.98 8.26,54.99 8.13,54.61 7.87,54.74 v8,54.74 | IC6.10 93.09,29.46 91.19,27.56 79.63,27.56 76.2,30.99 70.1,30.99 | v8.26,32.51 8.26,37.72 8.64,38.1 8.64,53.47 9.14,53.98 | 25.53,58.55 25.27,58.55 21.46,54.74 13.72,54.74 12.95,53.98 9.14,53.98 | IC2.10 25.4,58.67 25.53,58.55 | 47.37,29.59 53.72,29.59 56.01,27.3 67.44,27.3 70.1,29.97 70.1,30.99
N$139
  Bottom 0.406: U$2.3 83.44,8 84.71,6.73 LAYERS.5
N$140  (via drill 0.6 pad 1.68)  (1 unrouted)
  Top 0.1: v11.81,55.63 v11.81,65.53 | v102.49,36.96 v102.49,64.14 | v39.5,29.97 v39.5,13.72
  Bottom 0.406: 45.72,60.83 45.72,60.96 | IC9.12 22.1,34.39 22.1,37.21 22.99,38.1 32.26,38.1 33.53,36.83 33.53,31.75 35.31,29.97 v39.5,29.97 | v11.81,65.53 11.81,65.66 8.64,68.83 5.84,68.83 5.71,68.96 R65.2 | v102.49,36.96 91.31,36.96 90.55,36.2 IC6.12 90.55,30.73 89.28,29.46 81.28,29.46 79.76,30.99 79.76,36.07 77.6,38.23 69.21,38.23 67.69,36.83 IC7.12 67.69,30.1 66.8,29.21 57.02,29.21 55.5,30.73 55.5,35.81 53.09,38.23 46.74,38.23 44.96,36.45 44.96,34.39 IC8.12 44.83,32.38 42.42,29.97 v39.5,29.97 | v39.5,13.72 39.5,11.3 41.4,9.4 44.82,9.4 IC1.44 | v11.81,55.63 20.95,55.63 22.86,57.53 IC2.12 22.86,63.88 23.75,64.9 31.24,64.9 32.77,63.5 32.77,59.44 33.53,58.67 45.21,58.67 45.72,59.18 IC3.12 45.72,64.26 46.74,65.28 55.37,65.28 57.02,63.63 57.02,59.69 57.79,58.93 68.33,58.93 68.58,59.18 IC4.12 68.58,64.01 69.98,65.15 78.23,65.15 80.26,63.37 80.26,59.69 81.15,58.8 91.06,58.8 91.44,59.18 IC5.12 91.44,63.12 92.46,64.14 v102.49,64.14 | v39.5,29.97 39.37,29.34
N$141  (via drill 0.6 pad 1.68)
  Top 0.1: v33.78,12.45 v42.29,12.45
  Bottom 0.406: AVR-ISP.3 v33.78,12.45 | IC1.2 44.83,14.22 42.8,12.45 v42.29,12.45
N$142
  Bottom 0.406: KONWERTER-USB.4 23.11,23.37 24,24.26 36.7,24.26 41.02,19.94 47.09,19.94 IC1.9
N$143
  Bottom 0.406: KONWERTER-USB.3 20.57,23.75 21.84,25.02 37.47,25.02 41.53,20.95 47.2,20.95 IC1.10
N$150
  Bottom 0.406: IC1.7 46.73,18.03 35.18,18.03 34.65,17.51 Q1.2 34.62,16.89 C1.2
N$151
  Bottom 0.406: IC1.8 46.97,18.92 38.86,18.92 38.07,19.72 Q1.1 35.85,22.48 C2.2
N$152
  Bottom 0.406: IC1.29 57.15,5.35 57.15,4.06 57.91,3.3 60.58,3.3 61.85,4.57 C3.2
N$156
  Bottom 0.406: LED1.A R68.2
N$157
  Bottom 0.406: R69.2 50.93,25.25 LED2.A
N$166
  Bottom 0.406: IC1.11 51.08,20.14 R69.1
N$167
  Bottom 0.406: IC1.12 53.62,20.12 R68.1
N$168
  Bottom 0.406: U$5.3 79.38,8.76 82.04,6.1 LAYERS.6
N$169
  Bottom 0.406: AVR-ISP.7 28.7,9.63 R67.2 | IC1.4 45.24,16 38.1,16 37.34,15.24 30.86,15.24 30.35,15.75 | 30.35,15.75 29.97,16.13 C19.2 | 28.96,9.93 R67.2 | R67.2 28.98,12.45 | 28.98,12.45 28.98,14.38 30.35,15.75 | 28.98,12.45 28.95,12.48 S1.3 23.15,12.48 20.7,10.03 17.14,10.03 15.88,11.3 15.88,17.53 18.03,19.68 KONWERTER-USB.2
N$170
  Bottom 0.406: U$1.3 75.69,10.03 79.5,6.22 79.5,5.21 LAYERS.7
N$171
  Bottom 0.406: U$4.3 71.75,10.41 LAYERS.8
N$172
  Bottom 0.406: LAYERS.4 87.25,11.22 U$3.3
N$173
  Bottom 0.406: U$6.3 91.31,8 89.92,6.6 89.92,5.21 LAYERS.3
N$174
  Bottom 0.406: U$8.3 95.12,8.76 LAYERS.2
N$175
  Bottom 0.406: LAYERS.1 95.25,5.08 99.44,9.27 U$7.3
N$178
  Bottom 0.406: POWER-LED.A 6.96,80.39 R70.2

### Text on the board
Bottom: CubeX2000 | Marcin Przadka.net